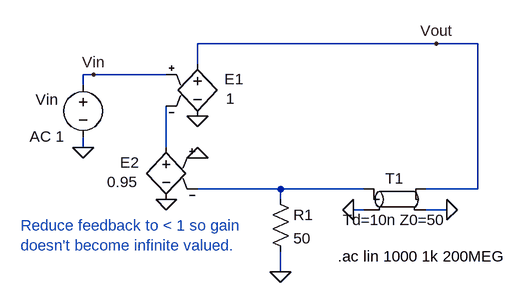
[diagram p0: schematic _Fig1_27_AC_MSD.asc]
_Fig1_27_AC_MSD.asc, the LTspice schematic file:
Version 4
SHEET 1 1056 688
WIRE 512 288 144 288
WIRE 576 288 512 288
WIRE 144 320 144 288
WIRE -16 336 -32 336
WIRE 96 336 -16 336
WIRE -32 352 -32 336
WIRE -32 448 -32 432
WIRE 96 448 96 384
WIRE 272 512 144 512
WIRE 400 512 272 512
WIRE 576 512 576 288
WIRE 576 512 496 512
WIRE 272 528 272 512
WIRE 400 544 384 544
WIRE 528 544 496 544
WIRE 272 640 272 608
FLAG 272 640 0
FLAG 528 544 0
FLAG 384 544 0
FLAG -32 448 0
FLAG -16 336 Vin
FLAG 512 288 Vout
FLAG 144 400 0
FLAG 96 528 0
FLAG 144 464 0
SYMBOL tline 448 528 R0
SYMATTR InstName T1
SYMATTR Value Td=10n Z0=50
SYMBOL res 256 512 R0
SYMATTR InstName R1
SYMATTR Value 50
SYMBOL voltage -32 336 R0
WINDOW 0 -73 38 Left 0
WINDOW 123 -82 95 Left 0
WINDOW 39 0 0 Left 0
SYMATTR InstName Vin
SYMATTR Value2 AC 1
SYMATTR Value ""
SYMBOL e 144 304 R0
WINDOW 0 42 39 Left 0
WINDOW 3 44 69 Left 0
SYMATTR InstName E1
SYMATTR Value 1
SYMBOL e 96 432 M0
WINDOW 0 42 39 Left 0
WINDOW 3 44 69 Left 0
SYMATTR InstName E2
SYMATTR Value 0.95
TEXT 360 616 Left 0 !.ac lin 1000 1k 200MEG
TEXT -128 568 Left 0 ;Reduce feedback to < 1 so gain \ndoesn't become infinite valued.

The netlist it stands for:
* _Fig1_27_AC_MSD.asc
T1 N002 0 Vout 0 Td=10n Z0=50
R1 N002 0 50
Vin Vin 0 AC 1
E1 Vout 0 Vin N001 1
E2 N001 0 0 N002 0.95
.ac lin 1000 1k 200MEG
* Reduce feedback to < 1 so gain
* doesn't become infinite valued.
.backanno
.end